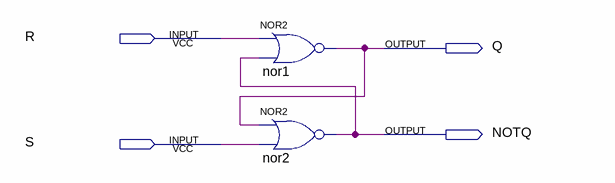
[diagram p0: schematic sheet]
// Quartus schematic SRLatch.bdf as structural Verilog: 2 symbols, 4 pins
module SRLatch (
  input  R,
  input  S,
  output Q,
  output NOTQ
);

  nor nor1 (Q, R, NOTQ);
  nor nor2 (NOTQ, Q, S);
endmodule
